# Altium schematic sheet Sheet1.SchDoc
size A4
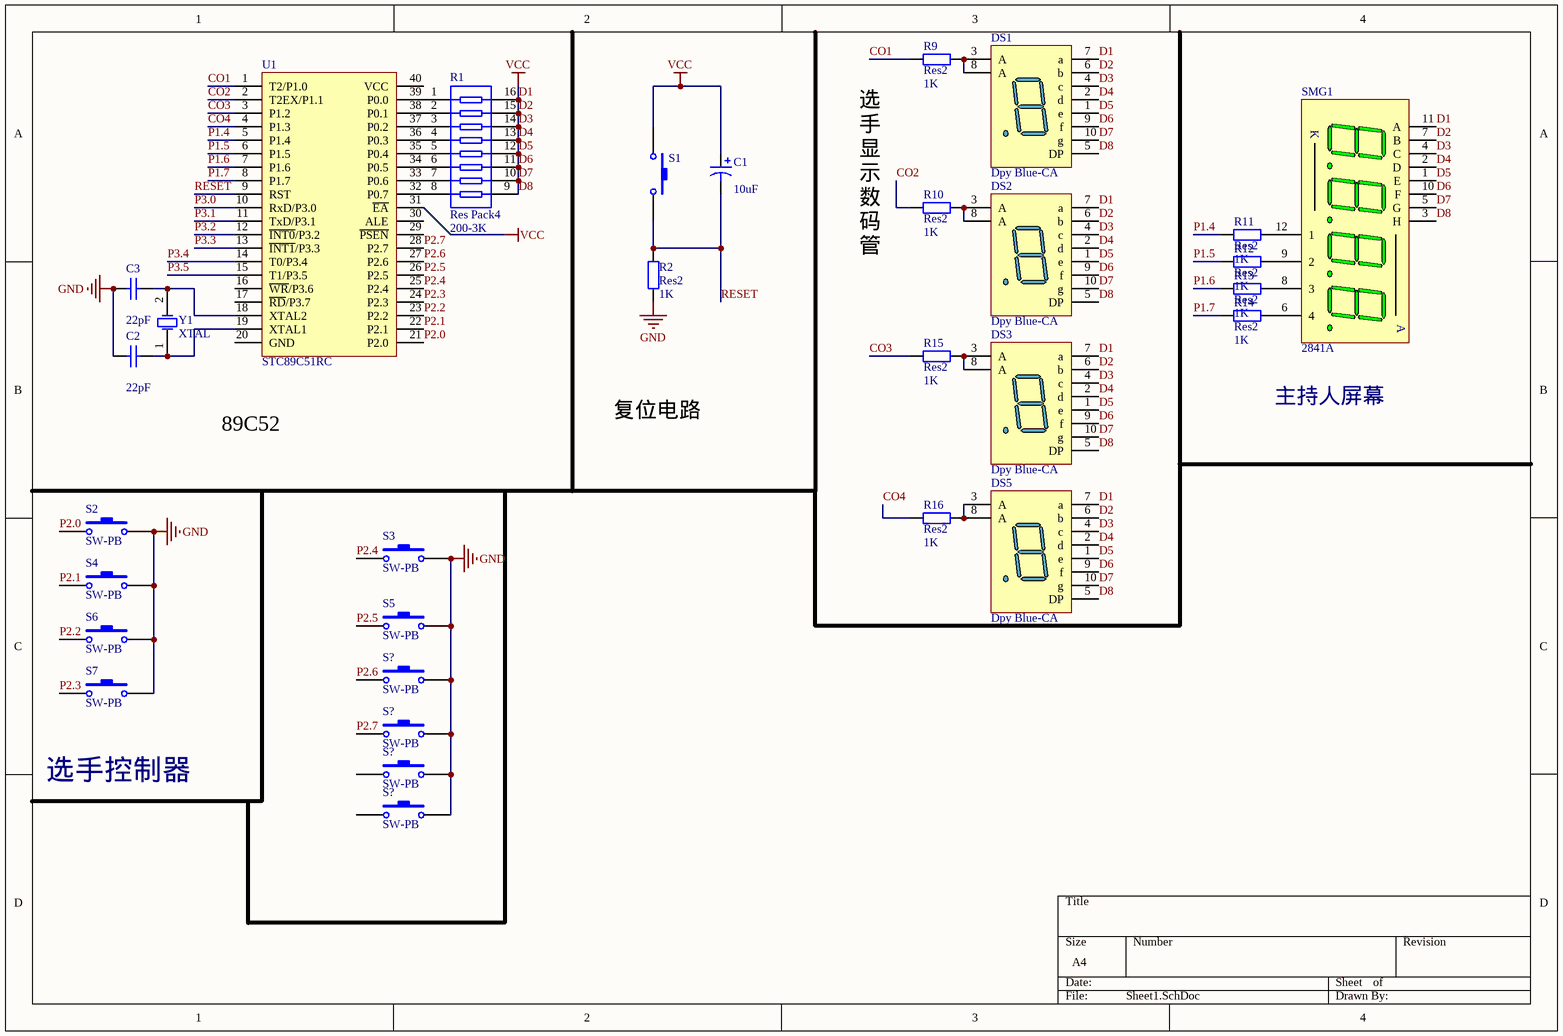
[diagram p0: Sheet1.SchDoc]

## Parts
(Parts that share a designator on the sheet are numbered #1, #2 ... from top to bottom, then left to right.)
C1  value 10uF  [RB7.6-15]  (hidden comment: Cap Pol1)
C2  value 22pF  [RAD-0.3]  (hidden comment: Cap)
C3  value 22pF  [RAD-0.3]  (hidden comment: Cap)
DS1  Dpy Blue-CA  [H]
DS2  Dpy Blue-CA  [H]
DS3  Dpy Blue-CA  [H]
DS5  Dpy Blue-CA  [H]
R1  Res Pack4  value 200-3K  [SSOP16_N]
R2  Res2  value 1K  [AXIAL-0.4]
R9  Res2  value 1K  [AXIAL-0.4]
R10  Res2  value 1K  [AXIAL-0.4]
R11  Res2  value 1K  [AXIAL-0.4]
R12  Res2  value 1K  [AXIAL-0.4]
R13  Res2  value 1K  [AXIAL-0.4]
R14  Res2  value 1K  [AXIAL-0.4]
R15  Res2  value 1K  [AXIAL-0.4]
R16  Res2  value 1K  [AXIAL-0.4]
S1  SW-PB  [SPST-2]  (value not drawn)
S2  SW-PB  [SPST-2]
S3  SW-PB  [SPST-2]
S4  SW-PB  [SPST-2]
S5  SW-PB  [SPST-2]
S6  SW-PB  [SPST-2]
S7  SW-PB  [SPST-2]
S?#1  SW-PB  [SPST-2]
S?#2  SW-PB  [SPST-2]
S?#3  SW-PB  [SPST-2]
S?#4  SW-PB  [SPST-2]
SMG1  2841A  [SMG 0.28-4P_B]
U1  STC89C51RC  [DIP40-600]
Y1  XTAL  [R38]

## Nets
D1: C1.1 DS1.1(e) DS1.2(d) DS1.4(c) DS1.5(DP) DS1.6(b) DS1.7(a) DS1.9(f) DS1.10(g) DS2.1(e) DS2.2(d) DS2.4(c) DS2.5(DP) DS2.6(b) DS2.7(a) DS2.9(f) DS2.10(g) DS3.1(e) DS3.2(d) DS3.4(c) DS3.5(DP) DS3.6(b) DS3.7(a) DS3.9(f) DS3.10(g) DS5.1(e) DS5.2(d) DS5.4(c) DS5.5(DP) DS5.6(b) DS5.7(a) DS5.9(f) DS5.10(g) R1.9 R1.10 R1.11 R1.12 R1.13 R1.14 R1.15 R1.16 S1.1 SMG1.1(E) SMG1.2(D) SMG1.3(H) SMG1.4(C) SMG1.5(G) SMG1.7(B) SMG1.10(F) SMG1.11(A) U1.31(~{EA})  [also labelled D2, D3, D4, D5, D6, D7, D8, VCC]
GND: C2.1 C3.1 R2.1 S2.2 S3.2 S4.2 S5.2 S6.2 S7.2 S?#1.2 S?#2.2 S?#3.2 S?#4.2
CO1: R9.1 U1.1(T2/P1.0)
CO2: R10.1 U1.2(T2EX/P1.1)
CO3: R15.1 U1.3(P1.2)
CO4: R16.1 U1.4(P1.3)
P1.4: R11.1 U1.5(P1.4)
P1.5: R12.1 U1.6(P1.5)
P1.6: R13.1 U1.7(P1.6)
P1.7: R14.1 U1.8(P1.7)
P2.0: S2.1 U1.21(P2.0)
P2.1: S4.1 U1.22(P2.1)
P2.2: S6.1 U1.23(P2.2)
P2.3: S7.1 U1.24(P2.3)
P2.4: S3.1 U1.25(P2.4)
P2.5: S5.1 U1.26(P2.5)
P2.6: S?#1.1 U1.27(P2.6)
P2.7: S?#2.1 U1.28(P2.7)
P3.0: U1.10(RxD/P3.0)
P3.1: U1.11(TxD/P3.1)
P3.2: U1.12(~{INT0}/P3.2)
P3.3: U1.13(~{INT1}/P3.3)
P3.4: U1.14(T0/P3.4)
P3.5: U1.15(T1/P3.5)
RESET: C1.2 R2.2 S1.2 U1.9(RST)
NetC2_2: C2.2 U1.19(XTAL1) Y1.1(OSC1)
NetC3_2: C3.2 U1.18(XTAL2) Y1.2(OSC2)
NetDS1_3: DS1.3(A) DS1.8(A) R9.2
NetDS2_3: DS2.3(A) DS2.8(A) R10.2
NetDS3_3: DS3.3(A) DS3.8(A) R15.2
NetDS5_3: DS5.3(A) DS5.8(A) R16.2
NetR1_1: R1.1 U1.39(P0.0)
NetR1_2: R1.2 U1.38(P0.1)
NetR1_3: R1.3 U1.37(P0.2)
NetR1_4: R1.4 U1.36(P0.3)
NetR1_5: R1.5 U1.35(P0.4)
NetR1_6: R1.6 U1.34(P0.5)
NetR1_7: R1.7 U1.33(P0.6)
NetR1_8: R1.8 U1.32(P0.7)
NetR11_2: R11.2 SMG1.12(1)
NetR12_2: R12.2 SMG1.9(2)
NetR13_2: R13.2 SMG1.8(3)
NetR14_2: R14.2 SMG1.6(4)

Not connected (* = marked no-connect by the designer): S?#3 1; S?#4 1; U1 16(~{WR}/P3.6) 17(~{RD}/P3.7) 20(GND) 29(~{PSEN}) 30(ALE) 40(VCC)

## Notes on the sheet
- 选手显示数码管
- 89C52
- 复位电路
- 主持人屏幕
- 选手控制器
- (in symbol 2841A) K

## Library data of the parts
C1 = Cap Pol1: Polarized Capacitor (Radial); Published: 8-Jun-2000; LatestRevisionDate: 17-Jul-2002; LatestRevisionNote: Re-released for DXP Platform.; PackageReference: RB7.6-15; Publisher: Altium Limited; PackageDescription: Polarized Capacitor (Radial); 2 Leads
C2 C3 = Cap: Capacitor; Published: 8-Jun-2000; LatestRevisionDate: 17-Jul-2002; LatestRevisionNote: Re-released for DXP Platform.; PackageReference: RAD-0.3; Publisher: Altium Limited; PackageDescription: Radial Cap, Thru-Hole; 2 Leads; 0.3 in Pin Spacing
DS1-DS3 DS5 = Dpy Blue-CA: 14.2 mm General Purpose Blue 7-Segment Display: CA, RH DP, Gray Surface; MinimumIntensity: 2020 ucd; Note: IF = 10 mA; Published: 8-Jun-2000; LatestRevisionDate: 17-Dec-2003; LatestRevisionNote: Schematic revised, PCB Footprint replaced.; DatasheetVersion: 24-Sep-2002; PackageVersion: 24-Sep-2002; PackageReference: H; Publisher: Altium Limited; PackageDescription: LED, 7-Segment Display, 14.2 mm, RHD; 10 Leads; Row Space 15.24 mm; Pitch 2.54 mm; Colour: Blue; ComponentLink1Description: Manufacturer Link; ComponentLink1URL: http://www.agilent.com/
R1 = Res Pack4: Isolated Resistor Network; Published: 24-Mar-1999; LatestRevisionDate: 29-May-2009; LatestRevisionNote: IPC-7351 Footprint Added.; PackageVersion: Oct-2003; PackageReference: SSOP16; Publisher: Altium Limited; PackageDescription: 16-Pin Plastic Small Outline Package 0.65 mm Pitch; Code_JEDEC: MO-150-AC; Code_IPC: SOP65P780-16
R2 R9-R16 = Res2: Resistor; Published: 8-Jun-2000; LatestRevisionDate: 17-Jul-2002; LatestRevisionNote: Re-released for DXP Platform.; PackageReference: AXIAL-0.4; Publisher: Altium Limited; PackageDescription: Axial Device, Thru-Hole; 2 Leads; 0.4 in Pin Spacing
S1-S7 S?#1-S?#4 = SW-PB: Switch; Published: 24-Mar-1999; LatestRevisionDate: 17-Jul-2002; LatestRevisionNote: Re-released for DXP Platform.; PackageReference: SPST-2; Publisher: Altium Limited; PackageDescription: Switch; 2 Leads
SMG1 = 2841A: 0.28寸4位共阴数码管; 版权归属: 源创客; BOM名称: 0.28寸4位共阴; 学习资源: www.ooocke.com
U1 = STC89C51RC: STC单片机; 版权归属: 源创客; BOM名称: STC单片机; 学习资源: www.ooocke.com
Y1 = XTAL: Crystal Oscillator; Published: 8-Jun-2000; LatestRevisionDate: 17-Jul-2002; LatestRevisionNote: Re-released for DXP Platform.; PackageReference: R38; Publisher: Altium Limited; PackageDescription: Crystal, Thru-Hole; 2 Leads; Body 3.1 x 8.2 mm (Dia.xH)